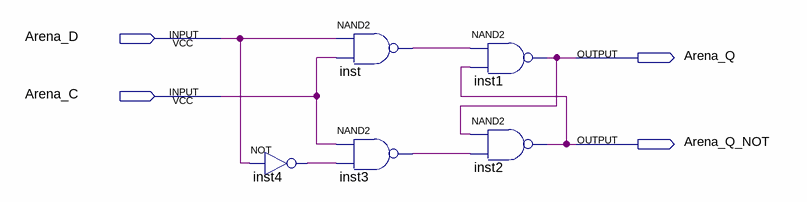
[diagram p0: schematic sheet]
// Quartus schematic Arena_DLatch.bdf as structural Verilog: 5 symbols, 4 pins
module Arena_DLatch (
  input  Arena_D,
  input  Arena_C,
  output Arena_Q,
  output Arena_Q_NOT
);

  wire inst3_out, inst4_out, inst_out;

  not inst4 (inst4_out, Arena_D);
  nand inst (inst_out, Arena_D, Arena_C);
  nand inst3 (inst3_out, Arena_C, inst4_out);
  nand inst1 (Arena_Q, inst_out, Arena_Q_NOT);
  nand inst2 (Arena_Q_NOT, Arena_Q, inst3_out);
endmodule
